# EAGLE board FPGA board V2 (EAGLE 7.6.0)
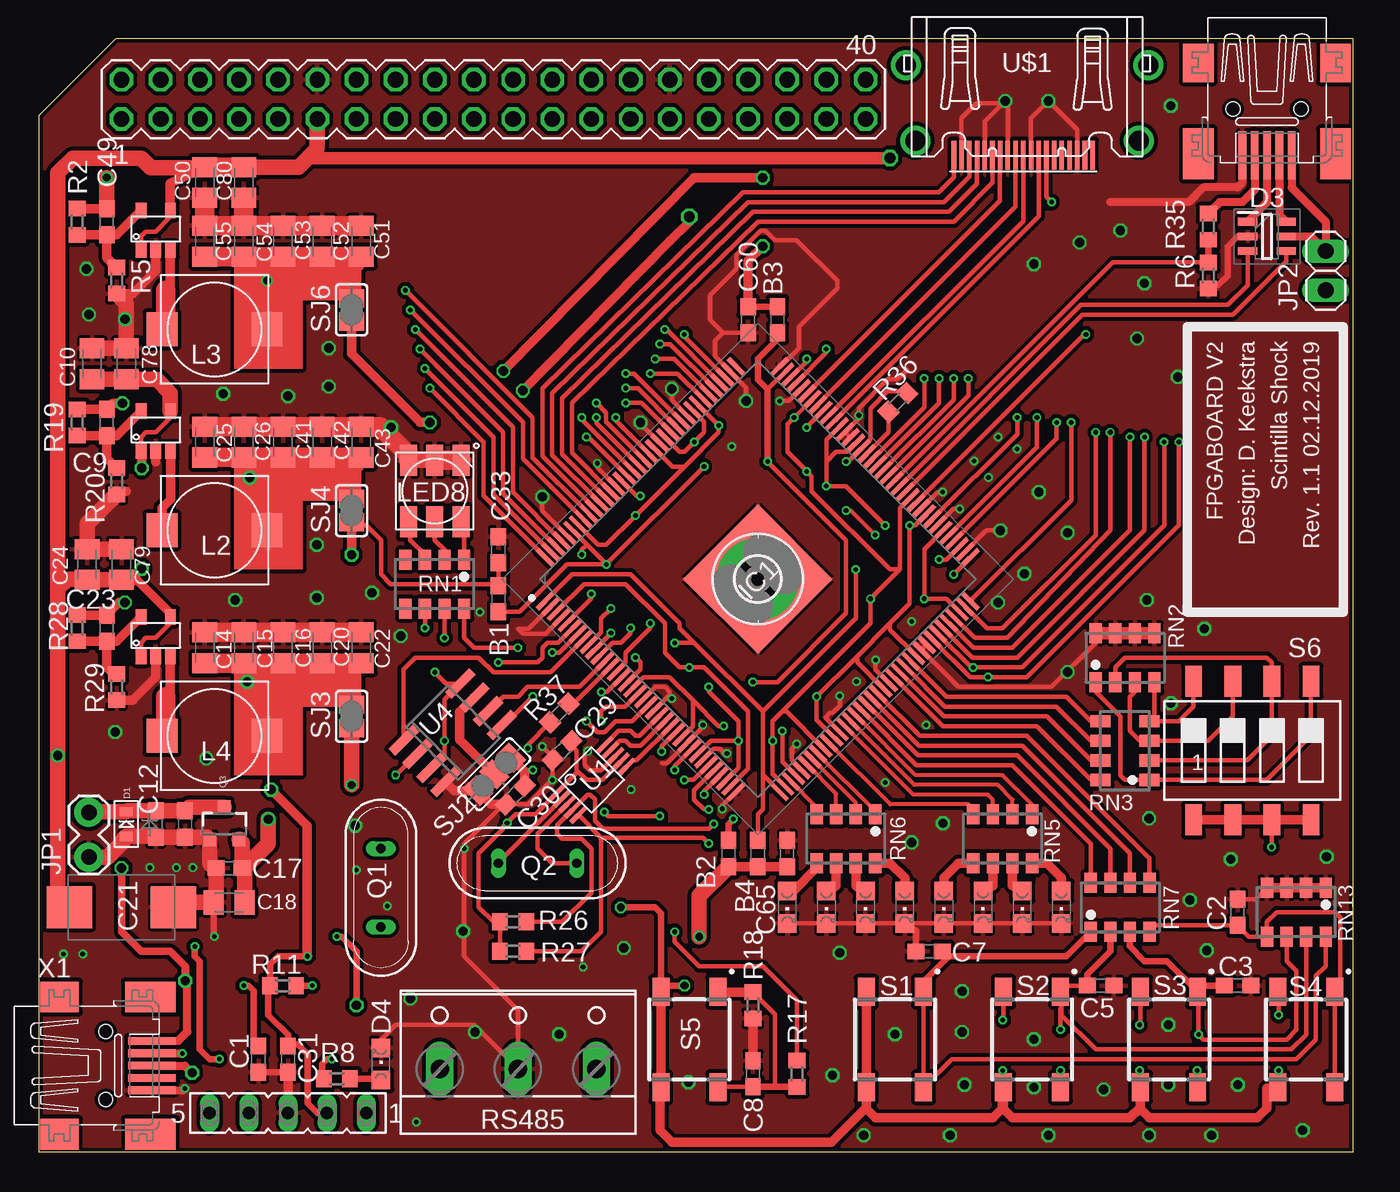
[diagram p6: board, top side]
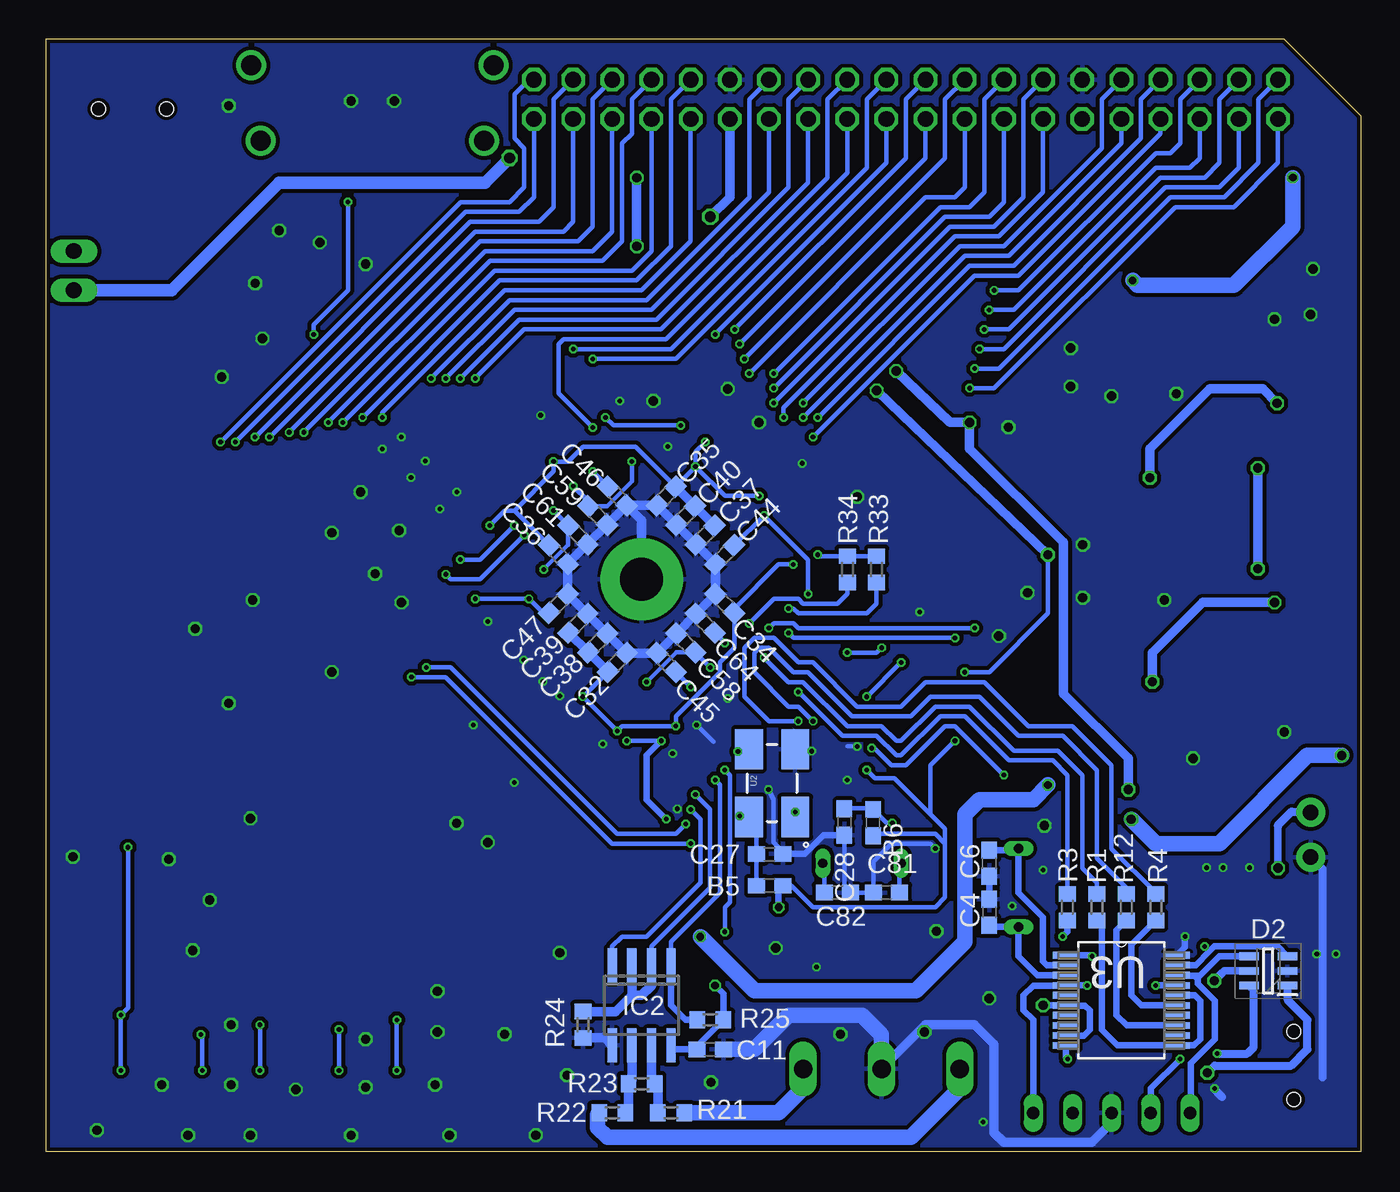
[diagram p7: board, bottom side, seen from below]

Size 85.26 x 72.19 mm. Coordinates in mm from the lower left corner, seen from the top.
Outline: 0,0 85.25,0 85.25,72.19 5,72.19 0,67.19 0,0
Copper layers (1*16): Top 0.018mm / dielectric 1.55mm / Bottom 0.018mm
Design rules "eC_2Layer_PClass6_BaseCopperO18_eCDefault *": minimum track width 0.15mm, minimum drill 0.3mm, track to track 0.15mm, track to pad 0.15mm, pad to pad 0.15mm, via to via 0.15mm, smd to smd 0mil, copper to edge 0.25mm, drill to drill 0.35mm, minimum pad ring 0.175mm, minimum via ring 0.125mm, stop-mask expansion 0mil, vias tented up to drill 0.35mm, thermal gap 0.2mm

## Footprints (pad centres in the part's own frame; a part is rotated, then mirrored left to right if it is on the bottom)
C0603 = smd 1.1 x 1: 1 -0.85,0; 2 0.85,0
C0805K = smd 1.3 x 1.6: 1 -1,0; 2 1,0
D/7343-31W = smd 2.95 x 2.7: + 3.375,0; - -3.375,0
SOD-523 = smd 0.8 x 0.6: A 0,-0.8; K 0,0.8
SOT95P275X110-6N = smd 1.25 x 0.5: 1 -1.25,0.95; 2 -1.25,0; 3 -1.25,-0.95; 4 1.25,-0.95; 5 1.25,0; 6 1.25,0.95
CHIPLED_0805 = smd 1.2 x 1.2: A 0,-1.05; C 0,1.05
2,8-PAD = drill 2.8 pad 5.334: B2,8 0,0
QFP50P2200X2200X165-145N = smd 1.475 x 0.3: 1 -10.738,8.75; 2 -10.738,8.25; 3 -10.738,7.75; 4 -10.738,7.25; 5 -10.738,6.75; 6 -10.738,6.25; 7 -10.738,5.75; 8 -10.738,5.25; 9 -10.738,4.75; 10 -10.738,4.25; 11 -10.738,3.75; 12 -10.738,3.25; 13 -10.738,2.75; 14 -10.738,2.25; 15 -10.738,1.75; 16 -10.738,1.25; 17 -10.738,0.75; 18 -10.738,0.25; 19 -10.738,-0.25; 20 -10.738,-0.75; 21 -10.738,-1.25; 22 -10.738,-1.75; 23 -10.738,-2.25; 24 -10.738,-2.75; 25 -10.738,-3.25; 26 -10.738,-3.75; 27 -10.738,-4.25; 28 -10.738,-4.75; 29 -10.738,-5.25; 30 -10.738,-5.75; 31 -10.738,-6.25; 32 -10.738,-6.75; 33 -10.738,-7.25; 34 -10.738,-7.75; 35 -10.738,-8.25; 36 -10.738,-8.75; 73 10.738,-8.75; 74 10.738,-8.25; 75 10.738,-7.75; 76 10.738,-7.25; 77 10.738,-6.75; 78 10.738,-6.25; 79 10.738,-5.75; 80 10.738,-5.25; 81 10.738,-4.75; 82 10.738,-4.25; 83 10.738,-3.75; 84 10.738,-3.25; 85 10.738,-2.75; 86 10.738,-2.25; 87 10.738,-1.75; 88 10.738,-1.25; 89 10.738,-0.75; 90 10.738,-0.25; 91 10.738,0.25; 92 10.738,0.75; 93 10.738,1.25; 94 10.738,1.75; 95 10.738,2.25; 96 10.738,2.75; 97 10.738,3.25; 98 10.738,3.75; 99 10.738,4.25; 100 10.738,4.75; 101 10.738,5.25; 102 10.738,5.75; 103 10.738,6.25; 104 10.738,6.75; 105 10.738,7.25; 106 10.738,7.75; 107 10.738,8.25; 108 10.738,8.75 | smd 0.3 x 1.475: 37 -8.75,-10.738; 38 -8.25,-10.738; 39 -7.75,-10.738; 40 -7.25,-10.738; 41 -6.75,-10.738; 42 -6.25,-10.738; 43 -5.75,-10.738; 44 -5.25,-10.738; 45 -4.75,-10.738; 46 -4.25,-10.738; 47 -3.75,-10.738; 48 -3.25,-10.738; 49 -2.75,-10.738; 50 -2.25,-10.738; 51 -1.75,-10.738; 52 -1.25,-10.738; 53 -0.75,-10.738; 54 -0.25,-10.738; 55 0.25,-10.738; 56 0.75,-10.738; 57 1.25,-10.738; 58 1.75,-10.738; 59 2.25,-10.738; 60 2.75,-10.738; 61 3.25,-10.738; 62 3.75,-10.738; 63 4.25,-10.738; 64 4.75,-10.738; 65 5.25,-10.738; 66 5.75,-10.738; 67 6.25,-10.738; 68 6.75,-10.738; 69 7.25,-10.738; 70 7.75,-10.738; 71 8.25,-10.738; 72 8.75,-10.738; 109 8.75,10.738; 110 8.25,10.738; 111 7.75,10.738; 112 7.25,10.738; 113 6.75,10.738; 114 6.25,10.738; 115 5.75,10.738; 116 5.25,10.738; 117 4.75,10.738; 118 4.25,10.738; 119 3.75,10.738; 120 3.25,10.738; 121 2.75,10.738; 122 2.25,10.738; 123 1.75,10.738; 124 1.25,10.738; 125 0.75,10.738; 126 0.25,10.738; 127 -0.25,10.738; 128 -0.75,10.738; 129 -1.25,10.738; 130 -1.75,10.738; 131 -2.25,10.738; 132 -2.75,10.738; 133 -3.25,10.738; 134 -3.75,10.738; 135 -4.25,10.738; 136 -4.75,10.738; 137 -5.25,10.738; 138 -5.75,10.738; 139 -6.25,10.738; 140 -6.75,10.738; 141 -7.25,10.738; 142 -7.75,10.738; 143 -8.25,10.738; 144 -8.75,10.738 | smd 6.85 x 6.85: 145 0,0
SO-08 = smd 0.6 x 2.2: 1 -1.905,-2.6; 2 -0.635,-2.6; 3 0.635,-2.6; 4 1.905,-2.6; 5 1.905,2.6; 6 0.635,2.6; 7 -0.635,2.6; 8 -1.905,2.6
1X02_LOCK = drill 1.016 pad 1.88: 1 -0.178,0; 2 2.718,0
1X02 = drill 1.016 long: 1 -1.27,0; 2 1.27,0
SLF7032T = smd 2 x 2.2: P$1 -3.4,0; P$2 3.4,0
RGBLED5050 = smd 2 x 1.1: 1 -2,1.7; 2 -2,0; 3 -2,-1.7; 4 2,-1.7; 5 2,0; 6 2,1.7
QS = drill 0.61 long: 1 -2.54,0; 2 2.54,0
SOT23-3 = smd 0.8 x 0.9: 1 -0.95,-1; 2 0.95,-1; 3 0,1.1
R0603 = smd 1 x 1.1: 1 -0.85,0; 2 0.85,0
744-8NS = smd 0.8 x 1.3: 1 -1.905,-1.587; 2 -0.635,-1.587; 3 0.635,-1.587; 4 1.905,-1.587; 5 1.905,1.587; 6 0.635,1.587; 7 -0.635,1.587; 8 -1.905,1.587
W237-3E = drill 1.194 long: 1 -5.08,-0.635; 2 0,-0.635; 3 5.08,-0.635
SKQGAKE010 = smd 1.8 x 1.1: 1 -3.1,1.85; 2 3.1,1.85; 3 -3.1,-1.85; 4 3.1,-1.85
SMS-004 = smd 1.092 x 2.007: 1 -3.81,-4.496; 2 -1.27,-4.496; 3 1.27,-4.496; 4 3.81,-4.496; 5 3.81,4.496; 6 1.27,4.496; 7 -1.27,4.496; 8 -3.81,4.496
SJ_2 = smd 1.168 x 1.6: 1 -1.524,0; 2 0,0; 3 1.524,0
SJ = smd 1.168 x 1.6: 1 -0.762,0; 2 0.762,0
FE05-1 = drill 0.813 long: 1 -5.08,0; 2 -2.54,0; 3 0,0; 4 2.54,0; 5 5.08,0
MA20-2 = drill 1.016 octagon: 1 -24.13,-1.27; 2 -24.13,1.27; 3 -21.59,-1.27; 4 -21.59,1.27; 5 -19.05,-1.27; 6 -19.05,1.27; 7 -16.51,-1.27; 8 -16.51,1.27; 9 -13.97,-1.27; 10 -13.97,1.27; 11 -11.43,-1.27; 12 -11.43,1.27; 13 -8.89,-1.27; 14 -8.89,1.27; 15 -6.35,-1.27; 16 -6.35,1.27; 17 -3.81,-1.27; 18 -3.81,1.27; 19 -1.27,-1.27; 20 -1.27,1.27; 21 1.27,-1.27; 22 1.27,1.27; 23 3.81,-1.27; 24 3.81,1.27; 25 6.35,-1.27; 26 6.35,1.27; 27 8.89,-1.27; 28 8.89,1.27; 29 11.43,-1.27; 30 11.43,1.27; 31 13.97,-1.27; 32 13.97,1.27; 33 16.51,-1.27; 34 16.51,1.27; 35 19.05,-1.27; 36 19.05,1.27; 37 21.59,-1.27; 38 21.59,1.27; 39 24.13,-1.27; 40 24.13,1.27
MSOP-10 = smd 1.4 x 0.3: 1 -2.2,1; 2 -2.2,0.5; 3 -2.2,0; 4 -2.2,-0.5; 5 -2.2,-1; 6 2.2,-1; 7 2.2,-0.5; 8 2.2,0; 9 2.2,0.5; 10 2.2,1
CRYSTAL-SMD-5X3_SOLDER = smd 2.6 x 1.8: 1 -2.2,-1.5; 2 2.2,-1.5; 3 2.2,1.5; 4 -2.2,1.5
SOP65P780X200-20N = smd 1.676 x 0.432: 1 -3.607,2.921; 2 -3.607,2.286; 3 -3.607,1.626; 4 -3.607,0.965; 5 -3.607,0.33; 6 -3.607,-0.33; 7 -3.607,-0.965; 8 -3.607,-1.626; 9 -3.607,-2.286; 10 -3.607,-2.921; 11 3.607,-2.921; 12 3.607,-2.286; 13 3.607,-1.626; 14 3.607,-0.965; 15 3.607,-0.33; 16 3.607,0.33; 17 3.607,0.965; 18 3.607,1.626; 19 3.607,2.286; 20 3.607,2.921
SOIC8 = smd 0.6 x 2.2: 1 -1.905,-2.6; 2 -0.635,-2.6; 3 0.635,-2.6; 4 1.905,-2.6; 5 1.905,2.6; 6 0.635,2.6; 7 -0.635,2.6; 8 -1.905,2.6
HDMI_A = smd 0.3 x 1.9: P$1 4.75,3.95; P$2 4.25,3.95; P$3 3.75,3.95; P$4 3.25,3.95; P$5 2.75,3.95; P$6 2.25,3.95; P$7 1.75,3.95; P$8 1.25,3.95; P$9 0.75,3.95; P$10 0.25,3.95; P$11 -0.25,3.95; P$12 -0.75,3.95; P$13 -1.25,3.95; P$14 -1.75,3.95; P$15 -2.25,3.95; P$16 -2.75,3.95; P$17 -3.25,3.95; P$18 -3.75,3.95; P$19 -4.25,3.95 | drill 1.3: P$20 -7.25,3; P$21 7.25,3; P$22 7.85,-1.9; P$23 -7.85,-1.9
TSOT-25 = smd 0.7 x 1: 1 -0.95,-1.2; 2 0,-1.2; 3 0.95,-1.2; 4 0.95,1.37; 5 -0.94,1.37
32005-201 = smd 3.1 x 0.5: 1 3,1.6; 2 3,0.8; 3 3,0; 4 3,-0.8; 5 3,-1.6 | smd 2.5 x 2: M1 -3,-4.45; M2 -3,4.45 | smd 3.3 x 2: M3 2.9,4.45; M4 2.9,-4.45 | hole 0.9: 0,2.2; 0,-2.2

## Placement (x,y rotation side)
B1  B-EU  [C0603]  29.83,35.86 270 top
B2  B-EU  [C0603]  44.75,19.35 90 top
B3  B-EU  [C0603]  47.92,53.96 270 top
B4  B-EU  [C0603]  46.65,19.35 90 top
B5  B-EU  [C0603]  38.35,17.26 180 bottom
B6  B-EU  [C0603]  31.64,21.35 90 bottom
C1  100nF  [C0603]  14.27,6.02 90 top
C2  100nF  [C0603]  77.77,15.54 90 top
C3  100nF  [C0603]  77.77,10.78 0 top
C4  16pF  [C0603]  24.11,15.54 270 bottom
C5  100nF  [C0603]  68.88,10.78 180 top
C6  16pF  [C0603]  24.11,18.72 90 bottom
C7  100nF  [C0603]  57.77,13 0 top
C8  100nF  [C0603]  46.34,5.07 90 top
C9  22pF  [C0603]  4.43,47.29 270 top
C10  10uF X5R  [C0805K]  3.47,51.1 90 top
C11  100nF  [C0603]  42.21,6.65 0 bottom
C12  22pF  [C0603]  7.6,21.26 270 top
C13  100nF  [C0603]  9.51,21.26 270 top
C14  10uF X5R  [C0805K]  10.78,32.69 90 top
C15  10uF X5R  [C0805K]  13.32,32.69 90 top
C16  10uF X5R  [C0805K]  15.86,32.69 90 top
C17  100nF  [C0603]  12.36,18.4 180 top
C18  10uF X5R  [C0805K]  12.36,16.18 180 top
C20  10uF X5R  [C0805K]  18.4,32.69 90 top
C21  330uF 10V (10tpe330m)  [D/7343-31W]  5.38,15.86 180 top
C22  10uF X5R  [C0805K]  20.94,32.69 90 top
C23  22pF  [C0603]  4.43,33.96 270 top
C24  10uF X5R  [C0805K]  3.16,38.09 90 top
C25  10uF X5R  [C0805K]  10.78,46.02 90 top
C26  10uF X5R  [C0805K]  13.32,46.02 90 top
C27  100nF  [C0603]  38.35,19.32 180 bottom
C28  100nF  [C0603]  33.5,21.39 90 bottom
C29  100nF  [C0603]  33.95,26.02 225 top
C30  100nF  [C0603]  30.91,23.14 45 top
C31  100nF  [C0603]  16.17,6.02 270 top
C32  100nF  [C0603]  48.24,31.74 45 bottom
C33  100nF  [C0603]  29.83,39.04 90 top
C34  100nF  [C0603]  41.26,35.55 135 bottom
C35  100nF  [C0603]  45.07,42.53 225 bottom
C36  100nF  [C0603]  52.05,38.72 315 bottom
C37  100nF  [C0603]  42.53,39.99 225 bottom
C38  100nF  [C0603]  49.51,33.01 45 bottom
C39  100nF  [C0603]  50.78,34.28 45 bottom
C40  100nF  [C0603]  43.8,41.26 225 bottom
C41  10uF X5R  [C0805K]  15.86,46.02 90 top
C42  10uF X5R  [C0805K]  18.4,46.02 90 top
C43  10uF X5R  [C0805K]  20.94,46.02 90 top
C44  100nF  [C0603]  41.26,38.72 225 bottom
C45  100nF  [C0603]  45.07,31.74 135 bottom
C46  100nF  [C0603]  48.24,42.53 315 bottom
C47  100nF  [C0603]  52.05,35.55 45 bottom
C49  22pF  [C0603]  4.43,60.31 270 top
C50  10uF X5R  [C0805K]  10.78,62.85 270 top
C51  10uF X5R  [C0805K]  20.94,59.04 90 top
C52  10uF X5R  [C0805K]  18.4,59.04 90 top
C53  10uF X5R  [C0805K]  15.86,59.04 90 top
C54  10uF X5R  [C0805K]  13.32,59.04 90 top
C55  10uF X5R  [C0805K]  10.78,59.04 90 top
C58  100nF  [C0603]  43.8,33.01 135 bottom
C59  100nF  [C0603]  49.51,41.26 315 bottom
C60  100nF  [C0603]  46.02,53.96 270 top
C61  100nF  [C0603]  50.78,39.99 315 bottom
C64  100nF  [C0603]  42.53,34.28 135 bottom
C65  100nF  [C0603]  48.56,19.35 90 top
C78  10uF X5R  [C0805K]  5.7,51.1 90 top
C79  10uF X5R  [C0805K]  5.38,38.09 90 top
C80  10uF X5R  [C0805K]  13.32,62.85 270 top
C81  16pF  [C0603]  30.78,16.81 0 bottom
C82  16pF  [C0603]  33.95,16.81 180 bottom
D1  Bi TVS 5V  [SOD-523]  5.7,21.26 0 top
D2  IP4234CZ6,125  [SOT95P275X110-6N]  6.01,11.73 180 bottom
D3  IP4234CZ6,125  [SOT95P275X110-6N]  79.67,59.36 0 top
D4  LED0805  [CHIPLED_0805]  22.21,5.7 0 top
H1  Ground pad for FPGA  [2,8-PAD]  46.65,37.13 0 top
IC1  10CL016YE144C8G  [QFP50P2200X2200X165-145N]  46.65,37.13 45 top
IC2  Any 3.3v rs485  [SO-08]  46.65,9.51 180 bottom
JP1  M02LOCK  [1X02_LOCK]  3.27,19.29 90 top
JP2  [1X02]  83.48,57.14 90 top
L2  3.3uH 1.9A PWR  [SLF7032T]  11.41,40.31 180 top
L3  3.3uH 1.9A PWR  [SLF7032T]  11.41,53.33 180 top
L4  3.3uH 1.9A PWR  [SLF7032T]  11.41,26.97 180 top
LED0  LED0805  [CHIPLED_0805]  48.56,15.86 180 top
LED1  LED0805  [CHIPLED_0805]  51.1,15.86 180 top
LED2  LED0805  [CHIPLED_0805]  53.64,15.86 180 top
LED3  LED0805  [CHIPLED_0805]  56.18,15.86 180 top
LED4  LED0805  [CHIPLED_0805]  58.72,15.86 180 top
LED5  LED0805  [CHIPLED_0805]  61.26,15.86 180 top
LED6  LED0805  [CHIPLED_0805]  63.8,15.86 180 top
LED7  LED0805  [CHIPLED_0805]  66.34,15.86 180 top
LED8  RGBLED5050  [RGBLED5050]  25.7,42.85 90 top
Q1  12MHz  [QS]  22.21,17.13 270 top
Q2  25MHz  [QS]  32.37,18.72 180 top
Q3  NTR2101P  [SOT23-3]  12.05,21.26 0 top
R1  0  [R0603]  17.13,15.86 90 bottom
R2  32k  [R0603]  2.52,60.31 90 top
R3  0  [R0603]  19.03,15.86 90 bottom
R4  0  [R0603]  13.32,15.86 90 bottom
R5  10k  [R0603]  5.06,56.5 90 top
R6  200  [R0603]  75.86,56.82 90 top
R8  1k  [R0603]  19.35,4.75 180 top
R11  10k  [R0603]  15.86,10.78 180 top
R12  0  [R0603]  15.22,15.86 90 bottom
R17  1k  [R0603]  49.19,5.07 90 top
R18  10k  [R0603]  46.34,9.51 90 top
R19  150k  [R0603]  2.52,47.29 90 top
R20  33k  [R0603]  5.06,43.48 90 top
R21  10  [R0603]  44.75,2.53 0 bottom
R22  10  [R0603]  48.56,2.53 180 bottom
R23  120  [R0603]  46.65,4.43 0 bottom
R24  10k  [R0603]  50.46,8.24 90 bottom
R25  10k  [R0603]  42.21,8.56 180 bottom
R26  2k2  [R0603]  30.78,14.91 0 top
R27  2k2  [R0603]  30.78,13 0 top
R28  100k  [R0603]  2.52,33.96 90 top
R29  100k  [R0603]  5.06,30.15 90 top
R33  10k  [R0603]  31.41,37.77 270 bottom
R34  10k  [R0603]  33.32,37.77 270 bottom
R35  100  [R0603]  75.86,59.99 90 top
R36  10k  [R0603]  55.74,48.6 45 top
R37  25R  [R0603]  33.78,28.45 45 top
RN1  1k  [744-8NS]  25.7,36.82 180 top
RN2  10k  [744-8NS]  70.47,32.05 0 top
RN3  1k  [744-8NS]  70.47,26.02 90 top
RN5  1k  [744-8NS]  62.53,20.31 180 top
RN6  1k  [744-8NS]  52.37,20.31 180 top
RN7  1k  [744-8NS]  70.15,15.86 0 top
RN13  10k  [744-8NS]  81.58,15.54 180 top
RS485  [W237-3E]  31.1,6.02 0 top
S1  SKQGADE010  [SKQGAKE010]  55.54,7.29 270 top
S2  SKQGADE010  [SKQGAKE010]  64.43,7.29 270 top
S3  SKQGADE010  [SKQGAKE010]  73.32,7.29 270 top
S4  SKQGADE010  [SKQGAKE010]  82.21,7.29 270 top
S5  SKQGADE010  [SKQGAKE010]  42.21,7.29 270 top
S6  SWS004  [SMS-004]  78.72,26.02 0 top
SJ2  [SJ_2]  29.56,24.49 225 top
SJ3  [SJ]  20.3,28.24 270 top
SJ4  [SJ]  20.3,41.58 270 top
SJ6  [SJ]  20.3,54.6 270 top
SV1  [FE05-1]  16.17,2.53 180 top
SV4  [MA20-2]  29.51,68.25 0 top
U1  [MSOP-10]  35.86,24.12 45 top
U2  OSCILLATOR5X3_SOLDER  [CRYSTAL-SMD-5X3_SOLDER]  38.19,23.92 90 bottom
U3  PIC18F14K50-I/SS  [SOP65P780X200-20N]  15.54,9.83 0 bottom
U4  IS25LQ040B-JNLE  [SOIC8]  26.87,27.18 315 top
U$1  HDMI  [HDMI_A]  64.12,68.57 180 top
U$3  AP3429  [TSOT-25]  7.6,46.66 0 top
U$7  AP3429  [TSOT-25]  7.6,33.32 0 top
U$11  AP3429  [TSOT-25]  7.6,59.68 0 top
X1  MINI-USB-32005-201  [32005-201]  4.36,5.6 0 top
X2  MINI-USB-32005-201  [32005-201]  79.67,67.61 270 top

## Tracks (layer width: path | path; a pad name or v marks a point on that pad's centre or on a via)
50MHZ_OUT  (via drill 0.3)
  Top 0.305: v40.41,25.97 40.41,26.29 IC1.25
  Bottom 0.305: U2.3 39.81,25.7 v40.41,25.97
+1V2  (via drill 0.5)
  Top 0.61: B2.1 B4.1 C65.1
  Top 1.016: SJ3.2 v20.3,23.8 | v42.84,13.96 42.84,16.6 B2.1
  Bottom 1.016: v42.84,13.96 39.35,10.46 28.87,10.46 25.7,13.64 25.7,21.89 24.75,22.85 21.25,22.85 v20.3,23.8
+2V5  (via drill 0.3, 0.6)
  Top 0.406: B3.1 C60.1 | v17.44,12.69 15.54,12.69 15.01,12.15 R11.2 14.9,10.78 14.9,10.68 14.9,10.27 14.9,8.88 16.17,7.61 C31.1 16.28,6.97 16.81,6.97 17.44,6.34 17.44,3.16 18.08,2.53 SV1.2
  Top 0.61: SJ6.2 20.3,51.74 24.75,47.3 v25.38,47.3 | C60.1 46.02,57.77 v46.97,58.72 | v46.97,63.17 42.53,63.17 v30.14,50.63 | v15.09,23.49 17.42,21.16 17.42,12.71 v17.44,12.69
  Bottom 0.406: U3.1 17.51,12.75 v17.44,12.69
  Bottom 0.61: v46.97,58.72 v46.97,63.17 | v30.14,50.63 26.65,47.3 v25.38,47.3 25.38,45.61 19.29,39.52 19.29,29.71 15.09,25.51 v15.09,23.49
+3V3  (via drill 0.3, 0.5, 0.6, 0.7)
  Top 0.305: U4.3 25.52,24.9 26.33,25.7 v26.33,26.66 26.33,29.34 U4.8 26.43,30.37 v25.7,31.1 | v32.05,24.75 31.57,24.75 31.51,24.7 | C33.1 B1.1 29.72,36.82 22.84,36.82 22.21,37.45 22.21,39.67 21.25,40.63 20.49,40.63 SJ4.2 20.43,40.95 | S2.3 62.58,8.6 v62.54,8.56 | v62.54,5.29 62.54,4.23 S2.4 | S3.3 71.47,8.31 v71.41,8.24 | v71.41,5.29 71.41,4.25 S3.4 | S4.4 80.36,5.38 v80.43,5.29 | v80.43,8.87 80.43,10.32 S4.3 | S6.3 79.99,19.78 v79.97,19.76
  Top 0.406: v41.89,10.78 40.75,10.78 S5.3 40.36,15.49 39.99,15.86 v37.76,15.86 | 40.3,2.53 40.3,2.85
  Top 0.61: SJ2.1 31.51,24.7 C30.2 | 53.69,2.79 S1.4 S1.3 | 53.69,2.79 54.27,2.21 61.89,2.21 62.53,2.85 62.53,4.13 S2.4 62.58,2.79 63.16,2.21 70.78,2.21 71.42,2.85 | 71.42,2.85 72.05,2.21 79.04,2.21 79.67,2.85 79.67,4.13 S4.4 | S3.4 71.47,2.9 71.42,2.85 | 53.69,2.79 53.58,2.79 51.42,0.62 41.07,0.62 40.3,1.39 40.3,2.85 40.3,4.13 S5.4 | S5.4 S5.3 | S6.1 S6.2 S6.3 S6.4 | v31.41,49.36 40.94,59.04 42.21,60.31 v42.21,60.63 | v20.3,38.72 SJ4.2 | 40.29,1.56 40.29,4.12 S5.4
  Bottom 0.305: 26.97,19.99 27.6,20.62 31.52,20.62 B6.1 | v32.05,24.75 31.52,24.22 30.25,24.22 27.92,21.89 | 26.97,19.99 26.97,20.94 27.92,21.89 | 27.92,21.89 27.92,25.07 v26.33,26.66 | 26.97,19.99 26.97,16.5 27.6,15.86 35.54,15.86 36.94,17.26 B5.1 | v25.7,31.1 24.11,31.1 20.3,34.91 v20.3,38.72 | v62.54,8.56 v62.54,5.29 | v71.41,8.24 v71.41,5.29 | v80.43,5.29 v80.43,8.87 79.97,9.34 v79.97,19.76
  Bottom 0.406: IC2.8 44.49,6.66 C11.1 43.06,6.76 42.84,6.97 42.84,7.08 R25.1 41.36,10.25 v41.89,10.78 | v37.76,15.86 37.76,16.9 B5.1
  Bottom 0.61: IC2.8 44.75,7.19 | v31.41,49.36 v20.3,38.72 | SV4.29 40.94,61.9 v42.21,60.63
+5V  (via drill 0.6, 0.7)
  Top 0.305: U$3.4 8.55,47.61 7.6,46.66 6.97,46.66 6.65,46.34 U$3.1 6.69,45.42 | U$7.4 8.55,34.27 7.6,33.33 6.97,33.33 6.65,33.01 U$7.1 | U$11.1 6.65,59.36 6.97,59.68 7.6,59.68 8.55,60.63 U$11.4 | 6.38,37.09 6.38,37.49
  Top 0.61: 8.51,48.08 U$3.4 | C50.1 8.55,62.81 U$11.4 | 6.69,45.42 v6.69,44.34 | v6.69,37.8 6.63,37.8 | 6.63,37.8 5.91,37.09 | 6.38,37.09 8.55,34.91 U$7.4 | 6.63,37.8 6.63,37.74 6.38,37.49
  Top 0.813: v55.23,64.44 17.4,64.44 16.81,63.85
  Top 1.016: 1.25,36.5 1.25,63.49 2.2,64.44 6.65,64.44 7.28,63.8 13.27,63.8 C80.1 16.81,63.85 16.86,63.85 18.08,65.08 SV4.11 | 1.25,36.5 1.89,37.13 3.11,37.13 C24.1 C79.1 5.91,37.09 | U$3.4 8.55,49.2 7.65,50.1 C78.1 C10.1 | 1.25,36.5 v1.25,25.7 1.25,16.61 C21.+ 1.89,15.74 | Q3.2 13.21,20.04 C17.1 13.36,18.25 C18.1 13.36,18.45 14.9,19.99 v14.9,21.58
  Top 1.27: C50.1 C80.1
  Bottom 0.61: v6.69,44.34 v6.69,37.8
  Bottom 0.813: JP2.1 77.13,55.87 70.15,62.85 56.81,62.85 v55.23,64.44
  Bottom 1.016: v1.25,25.7 3.47,25.7 9.19,19.99 13.32,19.99 v14.9,21.58
CLK_SCL  (via drill 0.3)
  Top 0.305: R26.2 33.95,14.91 35.86,16.82 35.86,19.67 35.22,20.31 33.95,20.31 33.64,20.62 33.64,21.19 U1.4 35.61,23.16 35.78,23.16 36.09,22.85 36.09,21.47 36.62,20.94 43.48,20.94 v43.8,21.26 | IC1.66 60.5,31.42 v60.62,31.42 63.8,31.42 73.01,40.63 v73.01,46.02
  Bottom 0.305: v43.8,21.26 44.43,20.62 48.24,20.62 59.04,31.42 v60.62,31.42 | SV4.39 53.64,61.9 54.59,60.95 58.08,60.95 v73.01,46.02
CLK_SDA  (via drill 0.3)
  Top 0.305: 36.49,20.37 U1.5 | R27.2 35.22,13.01 36.49,14.28 36.49,20.37 | 36.49,20.37 43.1,20.37 v43.48,19.99 | IC1.65 60.43,30.79 v61.58,30.79 64.12,30.79 73.96,40.63 v73.96,46.02
  Bottom 0.305: v43.48,19.99 48.56,19.99 59.35,30.79 v61.58,30.79 | SV4.40 53.96,69.52 54.91,68.57 54.91,65.71 54.27,65.08 54.27,62.53 55.23,61.58 58.4,61.58 v73.96,46.02
D+  (via drill 0.3)
  Top 0.406: v10.14,13.32 10.14,12.69 10.46,12.37 10.46,6.66 11.09,6.02 v11.73,6.02
  Bottom 0.406: 9.82,13.01 9.51,13.32 5.4,13.32 D2.3 | U3.19 10.71,12.12 9.82,13.01 | 9.82,13.01 v10.14,13.32 | v11.73,6.02 13.63,4.12 SV1.4
D-
  Bottom 0.406: D2.4 9.19,12.69 10.46,11.42 10.79,11.42 | U3.18 11.89,11.42 10.79,11.42 | 10.79,11.42 10.58,11.2 10.58,10.89 9.49,9.8 9.49,7.31 11.05,5.76 11.05,2.58 SV1.5
FL_CE
  Top 0.305: IC1.8 33.2,31.1 29.51,31.1 28.56,32.05 24.43,32.05 23.68,31.31 U4.1
FL_CLK
  Top 0.305: U4.6 29.2,28.57 30.14,29.52 31.1,29.52 31.73,30.15 35.07,30.15 IC1.12
FL_SI  (via drill 0.3)
  Top 0.305: U4.5 30.21,27.68 v32.05,29.52 | v29.83,31.74 32.37,31.74 32.68,32.05 32.68,32.69 33,33.01 33.69,33.01 IC1.6
  Bottom 0.305: v32.05,29.52 v29.83,31.74
FL_SO
  Top 0.305: R37.2 34.68,29.05 IC1.13
GND  (via drill 0.3, 0.6)
  Top 0.254: IC1.95 IC1.96
  Top 0.305: IC1.19 40.02,30.15 40.62,30.15 40.94,29.83 40.94,29.65 40.69,29.4 | 40.69,29.4 IC1.21 | C29.2 33.35,24.15 v33.32,24.12 31.74,22.54 C30.1 30.16,22.54 27.6,19.99 v27.6,19.67 27.6,12.69 31.1,9.2 RS485.2 28.24,8.24 23.16,8.24 22.21,7.29 D4.C | U1.8 36.48,24.74 35.78,24.74 35.4,25.11 35.4,25.76 v35.63,25.98 | LED0.C LED1.C LED2.C LED3.C LED4.C LED5.C LED6.C LED7.C | IC1.64 IC1.63 59.65,30.15 65.7,30.15 68.56,33.01 RN2.8 | C2.2 78.94,16.39 RN13.4 | v39.05,47.3 39.2,47.14 39.2,47.06 IC1.123 | v41.07,49.47 41.07,48.73 IC1.118 | v32.67,42.47 32.67,41.57 IC1.140 | v36.25,44.65 36.25,44.36 IC1.131 | v45.9,48.7 45.9,49.56 IC1.110 43.87,51.58 43.87,52.58 44.4,53.11 | C60.2 44.4,53.11 | IC1.108 48.12,50.91 49.32,52.12 49.32,53.52 51.81,56.01 51.81,56.47 49.16,59.12 47.76,59.12 47.14,59.74 46.83,59.74 45.27,58.19 45.27,57.25 43.56,55.54 43.56,53.95 44.4,53.11 | v48.07,48.7 48.67,48.7 IC1.104 | 56.32,50.72 55.7,50.09 55.07,50.09 53.21,48.23 v53.21,47.76 53.21,47.58 IC1.96 | v58.65,42.78 58.31,42.78 IC1.82 | v62.39,40.29 61.48,40.29 IC1.74 | v59.74,41.69 59.34,41.69 IC1.79 | U$1.P$17 67.37,66.27 v65.5,68.14 64.37,67.01 U$1.P$11 | U$1.P$8 62.87,67.97 v62.7,68.14 | U$1.P$5 61.37,66.81 v62.7,68.14 | U$1.P$2 59.87,67.02 60.83,67.99 62.54,67.99 v62.7,68.14 | v54.3,31.89 54.3,31.26 IC1.57 | v51.96,29.56 51.96,28.94 51.49,28.47 51.34,28.47 51.03,28.16 IC1.48 | v49.16,26.45 48.85,26.14 48.85,25.39 IC1.41 | v44.65,25.82 44.49,25.82 44.18,26.14 43.79,26.14 IC1.30 | v44.34,22.25 44.34,22.45 IC1.36 | v41.07,29.4 40.69,29.4 | IC1.2 31.77,33.91 31.11,33.91 31.43,33.6 32.87,33.6 IC1.4 | 33.6,25.36 v32.67,26.29
  Top 0.305: 40.45,25.2 40.76,25.2 42.07,26.51 IC1.27 43.09,27.57
  Top 0.406: X2.5 78.07,64.11 | D3.2 77.77,59.36 77.13,58.73 77.13,56.82 76.5,56.19 76.08,56.19 R6.1 75.65,56.19 | C31.2 C1.1 | v11.41,13.96 11.36,14.01 C18.2 | C7.1 56.92,14.38 LED3.C
  Top 0.508: X2.5 78.07,62.84 77.77,62.53 75.55,62.53 74.59,61.58 69.51,61.58 | X1.5 9.39,4 v9.51,4.12
  Top 0.61: U$7.2 7.6,30.79 6.12,29.3 R29.1 | R5.1 6.12,55.65 7.6,57.14 U$11.2 | U$3.2 7.6,44.76 | 5.7,42.85 5.28,42.85 R20.1 | C30.1 29.36,22.54 SJ2.3 26.96,23.41 U4.4 | RN13.1 RN13.2 RN13.3 RN13.4 | C8.2 R18.1 | SV1.3 C31.2
  Top 0.813: RN2.5 RN2.6 RN2.7 RN2.8
  Top 1.016: LED8.5 LED8.6 | C79.2 C24.2 3.16,40.73 R20.1 | C10.2 C78.2 5.7,55.02 R5.1 | C21.- 8.55,15.86 8.87,16.18 C18.2 11.51,16.33 C17.2 11.41,18.4 11.09,18.72 Q3.1 10.95,20.41 C13.2 C12.2 7.55,20.46 D1.A 5.5,20.26 5.5,20.12 4.49,19.11 JP1.1
  Top 1.27: C25.2 C26.2 C41.2 C42.2 C43.2 22.16,47.02 24,45.19 LED8.6 | C14.2 C15.2 C16.2 C20.2 C22.2 | C54.2 C55.2 C50.2 | C54.2 C53.2 C52.2 C51.2 | LED8.4 LED8.5 | C80.2 C54.2
  Bottom 0.254: 51.45,36.07 51.37,36.07 C39.2
  Bottom 0.305: C28.1 33.5,16.9 C82.1 C81.1 31.63,18.82 30.46,19.99 27.92,19.99 v27.6,19.67 | v35.63,25.98 36.56,25.98 U2.2 | v32.67,26.29 33.29,26.29 | v38.43,23.49 38.12,22.87 38.12,20.07 37.34,19.29 37.49,19.29 | v43.09,27.69 42.01,26.6
  Bottom 0.406: C4.1 C6.1 | U3.20 11.41,13.27 v11.41,13.96 | C28.1 34.85,20.54 36.07,19.32 C27.1
  Bottom 0.508: 2.84,18.68 JP1.1 2.49,18.34 2.49,4.82 | v9.51,4.12 9.51,4.06 9.02,3.58
  Bottom 0.61: U2.2 36.57,25.15 | R24.1 49.04,7.39 IC2.5 | 51.45,36.07 C47.2 | C47.2 C36.2 C61.2 C59.2 47.67,41.9 47.61,41.9 46.65,40.95 H1.B2,8 | C46.2 C35.2 C40.2 C37.2 C44.2 C34.2 C64.2 C58.2 C45.2 C32.2 C38.2 C39.2 C47.2 | SV1.3 16.17,1.89 17.44,0.62 23.16,0.62 23.79,1.26 23.79,6.97 25.06,8.24 28.24,8.24 RS485.2
  Bottom 1.016: RS485.2 31.1,7.61 32.37,8.88 37.13,8.88 39.35,6.66 C11.2
  other vias: 20.54,21.16 27.54,14.31 37.96,13.22 28.31,7.78 33.76,7.62 42.16,4.51 55.54,7.62 59.9,10.42 59.9,7.78 51.96,12.91 53.52,1.09 59.12,1.09 60.05,4.36 64.56,7.31 69.08,4.04 65.5,1.09 64.56,4.2 73.28,4.36 77.79,4.36 75.77,13.07 73.28,8.25 74.68,16.34 77.32,18.98 83.54,19.14 81.99,1.4 76.08,1.09 72.03,1.09 72.03,21.62 73.43,29.09 75.61,33.92 71.88,35.78 64.87,42.78 71.25,52.74 73.9,50.25 64.56,57.56 67.52,58.96 70.16,59.74 71.72,56.32 73.43,67.83 18.82,49.63 18.82,52.12 16.18,49.01 11.98,49.16 18.05,35.94 12.76,35.78 18.05,39.36 10.89,25.51 4.98,27.23 24.11,9.96 21.62,36.25 23.49,33.45 44.96,45.74 60.67,44.81 62.23,46.36 63.47,45.58 61.61,43.72 66.74,40.14 63.94,37.49 62.23,35.63 22.87,46.98 56.63,20.07 58.65,21.31 54.92,23.96 57.56,27.69 53.05,30.49 22.63,15.94 20.6,18.27 24.49,1.94 1.62,12.83 2.87,12.83 7.22,18.43 8.93,18.43 10.02,18.43 66.74,31.11 35.32,11.98 51.5,4.98 3.11,57.25 3.27,54.3 5.6,53.98 56.63,34.38 28.63,35
  pour Top (isolate 0.254): 85.57,72.34 -0.16,72.34 -0.16,-0.31 85.57,0
  pour Bottom (isolate 0.254): 0,0 85.41,0 85.41,72.34 0,72.34
GPI_7  (via drill 0.3)
  Top 0.305: v35.54,46.34 35.68,46.34 IC1.129
  Bottom 0.305: SV4.7 13,66.03 22.21,56.82 25.06,56.82 v35.54,46.34
GPI_8  (via drill 0.3)
  Top 0.305: v35.22,47.61 35.22,47.5 IC1.128
  Bottom 0.305: SV4.8 14.27,68.25 14.27,65.71 22.52,57.45 25.38,57.45 v35.22,47.61
GPI_9  (via drill 0.3)
  Top 0.305: v36.18,47.61 36.18,47.26 IC1.127
  Bottom 0.305: SV4.9 15.54,65.39 22.84,58.09 25.7,58.09 v36.18,47.61
GPI_10  (via drill 0.3)
  Top 0.305: v36.18,48.56 36.81,47.93 36.81,47.33 IC1.126
  Bottom 0.305: SV4.10 16.81,68.25 16.81,65.08 23.16,58.73 26.02,58.73 v36.18,48.56
GPI_23  (via drill 0.3)
  Top 0.305: v57.45,50.15 57.45,48.28 IC1.91
  Bottom 0.305: SV4.25 35.86,62.85 45.38,53.33 54.27,53.33 v57.45,50.15
GPI_24  (via drill 0.3)
  Top 0.305: v58.4,50.15 58.4,48.53 IC1.90
  Bottom 0.305: SV4.26 37.13,68.25 37.13,62.53 45.7,53.96 54.59,53.96 v58.4,50.15
GPI_25  (via drill 0.3)
  Top 0.305: v59.35,50.15 59.35,48.77 IC1.89
  Bottom 0.305: SV4.27 38.4,62.22 46.02,54.6 54.91,54.6 v59.35,50.15
GPI_26  (via drill 0.3)
  Top 0.305: v60.31,50.15 60.31,49.02 IC1.88
  Bottom 0.305: SV4.28 39.67,68.25 39.67,61.9 46.34,55.23 55.23,55.23 v60.31,50.15
GPIO_1  (via drill 0.3)
  Top 0.305: v25.38,49.52 28.87,46.02 28.87,42.54 IC1.144
  Bottom 0.305: SV4.1 5.38,64.12 8.24,61.27 12.05,61.27 23.79,49.52 v25.38,49.52
GPIO_2  (via drill 0.3)
  Top 0.305: v25.06,50.79 29.51,46.34 29.51,42.61 IC1.143
  Bottom 0.305: SV4.2 6.65,68.25 6.65,64.12 8.87,61.9 12.36,61.9 23.48,50.79 v25.06,50.79
GPIO_3  (via drill 0.3)
  Top 0.305: v24.75,52.06 30.14,46.66 30.14,42.69 IC1.142
  Bottom 0.305: SV4.3 7.92,63.8 9.19,62.53 12.68,62.53 23.16,52.06 v24.75,52.06
GPIO_4  (via drill 0.3)
  Top 0.305: v24.43,53.33 30.78,46.98 30.78,42.76 IC1.141
  Bottom 0.305: SV4.4 9.19,68.25 9.19,64.12 10.14,63.17 13,63.17 22.84,53.33 v24.43,53.33
GPIO_5  (via drill 0.3)
  Top 0.305: v24.11,54.6 31.41,47.3 31.41,44.95 IC1.137
  Bottom 0.305: SV4.5 10.46,64.44 11.09,63.8 13.32,63.8 22.52,54.6 v24.11,54.6
GPIO_6  (via drill 0.3)
  Top 0.305: v23.79,55.87 32.05,47.61 32.05,45.02 IC1.136
  Bottom 0.305: SV4.6 11.73,68.25 11.73,65.39 12.36,64.76 13.32,64.76 22.21,55.87 v23.79,55.87
GPIO_11  (via drill 0.3)
  Top 0.305: v37.45,47.61 37.45,47.4 IC1.125
  Bottom 0.305: SV4.13 20.62,62.22 23.48,59.36 26.33,59.36 37.45,48.25 v37.45,47.61
GPIO_12  (via drill 0.3)
  Top 0.305: v38.08,48.56 39.11,48.56 IC1.121
  Bottom 0.305: SV4.14 21.89,68.25 21.89,61.9 23.79,59.99 26.65,59.99 v38.08,48.56
GPIO_13  (via drill 0.3)
  Top 0.305: v38.08,49.52 38.87,49.52 IC1.120
  Bottom 0.305: SV4.15 23.16,61.58 24.11,60.63 26.97,60.63 v38.08,49.52
GPIO_14  (via drill 0.3)
  Top 0.305: v38.08,50.47 38.62,50.47 IC1.119
  Bottom 0.305: SV4.16 24.43,68.25 24.43,62.22 25.38,61.27 27.29,61.27 v38.08,50.47
GPIO_15  (via drill 0.3)
  Top 0.305: v39.67,50.47 41.45,50.47 IC1.115
  Bottom 0.305: SV4.17 25.7,62.53 26.33,61.9 28.24,61.9 v39.67,50.47
GPIO_16  (via drill 0.3)
  Top 0.305: v39.99,51.42 41.2,51.42 IC1.114
  Bottom 0.305: SV4.18 26.97,68.25 26.97,64.44 v39.99,51.42
GPIO_17  (via drill 0.3)
  Top 0.305: v40.3,52.38 40.96,52.38 IC1.113
  Bottom 0.305: SV4.19 28.24,64.44 v40.3,52.38
GPIO_18  (via drill 0.3)
  Top 0.305: v40.62,53.33 40.71,53.33 IC1.112
  Bottom 0.305: SV4.20 29.51,68.25 29.51,64.44 v40.62,53.33
GPIO_19  (via drill 0.3)
  Top 0.305: v41.89,53.01 41.89,52.86 IC1.111
  Bottom 0.305: SV4.21 30.78,64.12 v41.89,53.01
GPIO_20  (via drill 0.3)
  Top 0.305: v49.83,51.42 49.83,51.27 IC1.106
  Bottom 0.305: SV4.22 32.05,68.25 32.05,63.8 44.43,51.42 v49.83,51.42
GPIO_21  (via drill 0.3)
  Top 0.305: v51.1,52.06 51.1,51.83 IC1.105
  Bottom 0.305: v51.1,52.06 44.75,52.06 33.32,63.49 SV4.23
GPIO_22  (via drill 0.3)
  Top 0.305: v49.83,46.98 49.83,47.03 IC1.100
  Bottom 0.305: SV4.24 34.59,68.25 34.59,63.17 45.07,52.69 51.73,52.69 52.05,52.38 52.05,49.2 v49.83,46.98
GPIO_27  (via drill 0.3)
  Top 0.305: v63.48,47.61 63.48,46.54 IC1.80
  Bottom 0.305: SV4.31 43.48,59.04 46.65,55.87 55.54,55.87 63.48,47.93 v63.48,47.61
GPIO_28  (via drill 0.3)
  Top 0.305: v64.75,47.61 64.75,45.69 IC1.77
  Bottom 0.305: SV4.32 44.75,68.25 44.75,58.73 46.97,56.5 55.86,56.5 v64.75,47.61
GPIO_29  (via drill 0.3)
  Top 0.305: v66.02,47.3 66.02,46.25 IC1.76
  Bottom 0.305: SV4.33 46.02,58.41 47.29,57.14 56.18,57.14 v66.02,47.3
GPIO_30  (via drill 0.3)
  Top 0.305: v66.97,47.3 66.97,42.27 IC1.72
  Bottom 0.305: SV4.34 47.29,68.25 47.29,66.03 47.92,65.39 47.92,59.04 49.19,57.77 56.5,57.77 v66.97,47.3
GPIO_31  (via drill 0.3)
  Top 0.305: v68.56,46.66 68.56,39.99 62.53,33.96 61.5,33.96 IC1.71
  Bottom 0.305: SV4.35 48.56,59.68 49.83,58.41 56.81,58.41 v68.56,46.66
GPIO_32  (via drill 0.3)
  Top 0.305: v69.51,46.66 69.51,40.31 62.85,33.33 60.72,33.33 IC1.69
  Bottom 0.305: SV4.36 49.83,68.25 49.83,59.99 50.78,59.04 57.13,59.04 v69.51,46.66
GPIO_33  (via drill 0.3)
  Top 0.305: v70.78,46.34 70.78,40.31 63.16,32.69 60.64,32.69 IC1.68
  Bottom 0.305: SV4.37 51.1,60.31 51.73,59.68 57.45,59.68 v70.78,46.34
GPIO_34  (via drill 0.3)
  Top 0.305: v71.74,46.34 71.74,40.31 63.48,32.05 60.57,32.05 IC1.67
  Bottom 0.305: SV4.38 52.37,68.25 52.37,61.27 53.32,60.31 57.77,60.31 v71.74,46.34
HDMI_CEC  (via drill 0.3)
  Top 0.305: U$1.P$13 65.37,61.92 v65.7,61.58 | v67.93,53.01 67.83,53.01 IC1.83
  Bottom 0.305: v65.7,61.58 65.7,55.87 67.93,53.65 v67.93,53.01
HDMI_CLKN
  Top 0.305: U$1.P$12 64.87,60.65 IC1.98
HDMI_CLKP
  Top 0.305: U$1.P$10 63.87,60.36 IC1.99
HDMI_DATA0N
  Top 0.305: U$1.P$9 63.37,61.27 IC1.101
HDMI_DATA0P
  Top 0.305: U$1.P$7 62.37,61.69 IC1.103
HDMI_DATA1N
  Top 0.305: U$1.P$6 61.87,62.83 59.35,60.31 46.65,60.31 34.59,48.56 34.59,45.32 IC1.132
HDMI_DATA1P
  Top 0.305: U$1.P$4 60.87,62.78 59.04,60.95 46.34,60.95 33.95,48.88 33.95,45.24 IC1.133
HDMI_DATA2N
  Top 0.305: U$1.P$3 60.37,63.23 58.72,61.58 46.02,61.58 33.32,49.2 33.32,45.17 IC1.134
HDMI_DATA2P
  Top 0.305: U$1.P$1 59.37,63.18 58.4,62.22 45.7,62.22 32.68,49.52 32.68,45.09 IC1.135
L2  (via drill 0.6)
  Top 0.61: R19.2 C9.1 4.82,48.54 v5.45,48.54 | 12.38,45.02 13.47,45.02 13.69,44.81 v13.69,43.72
  Top 1.27: C25.1 12.38,45.02 C26.1 C41.1 | C41.1 C42.1 C43.1 20.3,44.39 SJ4.1 | L2.P$1 14.81,43.98 C41.1
  Bottom 0.61: v13.69,43.72 13.69,45.58 9.8,49.47 6.38,49.47 v5.45,48.54
LED_0
  Top 0.254: RN6.4 50.46,22.36 IC1.39
LED_1
  Top 0.254: RN6.3 51.73,23.22 IC1.42
LED_2
  Top 0.254: RN6.2 53,22.65 IC1.43
LED_3
  Top 0.254: RN6.1 54.27,22.09 IC1.44
LED_4
  Top 0.254: RN5.4 60.62,22.21 60.31,22.53 55.25,22.53 IC1.46
LED_5
  Top 0.254: RN5.3 61.89,22.85 61.58,23.16 56.73,23.16 IC1.49
LED_6
  Top 0.254: RN5.2 63.16,22.85 62.21,23.8 56.81,23.8 IC1.50
LED_7
  Top 0.254: RN5.1 64.43,22.53 62.53,24.43 56.88,24.43 IC1.51
N$1  (via drill 0.3)
  Top 0.406: v19.03,6.02 18.71,6.02 18.4,5.7 18.4,4.85 R8.2
  Bottom 0.406: U3.10 19.14,6.13 v19.03,6.02
N$2
  Top 0.406: R8.1 22,4.75 D4.A
N$3
  Bottom 0.406: R1.1 16.81,14.7 16.81,7.92 15.79,6.91 U3.11 10.83,6.91 10.42,7.31 10.42,9.8 10.78,10.16 U3.16
N$4
  Top 0.61: U$11.3 8.55,56.18 8.24,55.87
  Top 1.27: 8.24,55.87 8.24,53.55 L3.P$2
N$5  (via drill 0.3)
  Top 0.406: v13.32,10.78 13.63,10.78 13.95,10.46 13.95,7.19 C1.2
  Bottom 0.406: U3.17 13.3,10.79 v13.32,10.78
N$6
  Bottom 0.406: R4.1 14.9,13.43 14.9,10.15 14.26,9.5 U3.15
N$7  (via drill 0.3)
  Top 0.406: v17.76,10.78 R11.1
  Bottom 0.406: SV1.1 21.25,8.56 21.89,9.2 21.89,10.15 21.25,10.78 U3.4 17.77,10.79 v17.76,10.78
N$8  (via drill 0.5)
  Top 0.61: C49.1 R2.2
  Top 1.016: C49.1 v4.43,63.17
  Top 1.27: C53.1 C52.1 C51.1 20.3,57.41 SJ6.1 | C53.1 C54.1 C55.1 | L3.P$1 v14.81,56.5 14.81,57 C53.1
  Bottom 1.016: v4.43,63.17 4.43,59.99 8.24,56.19 14.49,56.19 v14.81,56.5
N$9
  Top 0.61: C49.2 5.08,59.46 U$11.5 | C49.2 4.43,57.99 R5.2 | C49.2 R2.1
N$10  (via drill 0.3, 0.6)
  Top 0.406: v20.62,9.51 20.62,13.01 19.67,13.96 v19.35,13.96
  Bottom 0.305: 19.16,9.51 U3.6
  Bottom 0.406: 19.16,9.51 v20.62,9.51 | v19.35,13.96 19.03,14.28 R3.1 | U3.9 17.97,7.54 17.58,7.93 17.58,9.18 17.89,9.49 19.14,9.49 U3.6
N$11  (via drill 0.6)
  Top 0.508: X1.3 9.49,5.6 v9.96,5.13
  Bottom 0.406: D2.1 4.75,10.79
  Bottom 0.508: D2.1 4.74,10.77 4.74,9.83 3.47,8.56 3.47,6.66 4.53,5.6 9.49,5.6 v9.96,5.13
N$12
  Bottom 0.406: R12.1 15.86,14.38 15.86,8.88 15.18,8.2 U3.13
N$13  (via drill 0.3)
  Top 0.508: X1.2 9.31,6.4 v9.34,6.38
  Bottom 0.508: D2.6 6.97,10.49 6.97,6.79 7.38,6.38 v9.34,6.38
N$15
  Top 0.305: S6.7 77.45,28.25 75.86,26.66 RN3.3 71.42,26.66 70.78,27.29 70.78,29.52 71.1,29.83 RN2.3
N$16
  Bottom 0.406: C4.2 24.01,14.59 Q1.2 22.21,12.69 20.97,11.46 U3.3
N$17
  Bottom 0.406: C6.2 22.31,19.57 Q1.1 22.21,16.82 20.62,15.23 20.62,12.37 20.36,12.12 U3.2
N$22
  Top 0.305: S6.5 82.53,26.98 79.67,24.12 RN3.1 70.47,24.12 70.15,24.43 70.15,28.25 68.56,29.83 RN2.1
N$23
  Top 0.305: RN3.2 78.4,25.39 79.99,26.98 S6.6 79.99,31.74 79.67,32.05 70.47,32.05 69.83,31.42 RN2.2
N$24  (via drill 0.3)
  Top 0.305: IC1.9 36.49,33.69 36.49,34.59 v37.13,35.23
  Bottom 0.305: R33.2 31.41,35.55 32.05,34.91 36.49,34.91 36.81,35.23 v37.13,35.23
N$25
  Top 0.305: S6.8 74.91,28.88 73.96,27.93 RN3.4 72.37,28.25 RN2.4
N$29  (via drill 0.6)
  Top 0.305: C14.1 12.34,31.69 v13.54,30.49 | C16.1 14.58,31.69 13.38,30.49 14.65,30.49 14.81,30.34
  Top 0.61: R28.2 C23.1 5.24,35.63 v5.6,35.63
  Top 1.27: C14.1 C15.1 C16.1 C20.1 C22.1 20.57,31.69 20.3,31.42 SJ3.1 | L4.P$1 14.81,30.34 14.81,30.64
  Bottom 0.61: v13.54,30.49 13.54,32.36 10.27,35.63 v5.6,35.63
N$30
  Top 0.61: R29.2 4.85,31 4.43,31.42 C23.2 | C23.2 5.08,33.11 U$7.5 | R28.1 C23.2
N$31  (via drill 0.3)
  Top 0.305: v39.67,34.28 39.67,33.96 38.08,32.37 38.08,31.74 IC1.14
  Bottom 0.305: R34.2 33.32,36.18 33.95,35.55 36.18,35.55 36.49,35.87 38.08,35.87 v39.67,34.28
N$33
  Top 0.305: R36.1 55.13,46.68 IC1.92
N$45
  Top 0.61: RN5.8 65.39,18.72 66.34,17.77 LED7.A
N$46
  Top 0.61: RN5.7 63.16,17.25 LED6.A
N$47
  Top 0.61: RN5.6 61.89,17.25 LED5.A
N$48
  Top 0.61: RN5.5 59.67,18.72 58.72,17.77 LED4.A
N$49
  Top 0.61: RN6.8 55.23,18.72 56.18,17.77 LED3.A
N$50
  Top 0.508: X2.2 80.47,60.76 D3.6
N$51
  Top 0.61: RN6.7 53,17.25 LED2.A
N$52
  Top 0.61: RN6.6 51.73,17.25 LED1.A
N$53
  Top 0.61: 48.76,16.82 LED0.A 48.96,16.91 50.46,18.41 RN6.5
N$54
  Top 0.508: X2.3 79.67,61.56 D3.1
N$57
  Top 0.305: RN1.3 25.06,38.72 24.11,39.67 24.11,40.74 LED8.1
N$58
  Top 0.305: RN1.2 26.33,39.04 25.7,39.67 LED8.2
N$59
  Top 0.305: RN1.1 27.6,40.65 LED8.3
N$63
  Top 0.305: RN7.4 72.47,14.7 C2.1 78.51,13.96 RN13.5 79.67,14.91 80.31,15.54 84.12,15.54 84.44,15.23 84.44,10.76 S4.1 S4.2
N$64  (via drill 0.3)
  Top 0.305: RN13.6 80.94,12.37 81.58,11.73 81.58,7.92 80.94,7.29 75.55,7.29 v75.23,7.61 75.23,10.34 S3.1 | S3.2 75.17,5.26 v75.14,5.29
  Top 0.406: C3.1 75.57,10.78 S3.1 73.19,12.37 71.74,12.37 70.78,13.32 RN7.3
  Bottom 0.305: v75.14,5.29 75.14,7.52 v75.23,7.61
N$65  (via drill 0.3)
  Top 0.305: 66.34,9.34 66.34,8.88 68.56,6.66 81.26,6.66 82.21,7.61 RN13.7 | 66.34,9.34 66.34,10.34 S2.1 66.68,10.78 C5.2 | S2.2 66.28,5.44 v66.28,5.29 | v66.28,7.93 66.28,9.27 66.34,9.34
  Top 0.406: C5.2 68.03,11.52 69.51,13.01 RN7.2
  Bottom 0.305: v66.28,5.29 v66.28,7.93
N$67
  Top 0.305: RN13.8 83.48,12.05 82.85,11.42 82.85,7.29 81.58,6.02 59.22,6.02 S1.2 S1.1
  Top 0.406: 59.04,12.69 58.93,12.69 C7.2 | 59.04,12.69 66.66,12.69 RN7.1 | S1.1 57.39,11.04 59.04,12.69
N$68
  Top 0.305: S5.2 44.09,4.22 C8.1 47.74,4.22 47.76,4.2 47.76,8.94 R18.2
  Top 0.406: 46.34,4.19 C8.1 R17.1
  Top 0.61: R18.2 44.09,10.36 S5.1
N$75
  Top 0.305: Q2.1 33.32,18.72 32.37,19.67 32.37,20.62 U1.3
  Bottom 0.305: C82.2 34.8,18.62 Q2.1
N$76
  Top 0.305: Q2.2 29.83,18.79 U1.2
  Bottom 0.305: C81.2 29.93,18.62 Q2.2
N$77
  Top 0.508: X2.1 81.27,62.52 83.48,60.31 JP2.2 82.53,59.36 D3.5
N$78
  Top 0.61: L2.P$2 8.01,41.77 8.56,42.32 U$3.3
N$80
  Bottom 0.61: IC2.7 46.02,4.65 R23.2 45.6,4.23 R21.1
N$81
  Bottom 0.61: IC2.6 47.29,4.65 R23.1 47.5,2.73 R22.1
N$82
  Top 0.61: R19.1 C9.2 | C9.2 5.08,46.45 U$3.5 | C9.2 4.43,44.97 R20.2
N$83
  Bottom 1.016: RS485.1 26.02,4.12 29.19,0.94 48.88,0.94 49.51,1.57 49.51,2.42 R22.2
N$84
  Bottom 0.61: R21.2 43.48,2.53
  Bottom 1.016: RS485.3 36.18,4.12 37.76,2.53 R21.2
N$86
  Top 0.61: SJ2.2 27.32,26.73 27.32,28.53 U4.7
N$88
  Top 0.61: U$7.3 8.55,29.83 8.24,29.52
  Top 1.27: 8.24,29.52 8.24,27.2 L4.P$2
N$91  (via drill 0.3)
  Top 0.305: C29.1 34.55,26.37 34.91,26.02 34.91,24.75 | 34.91,24.75 34.91,24.58 U1.1 32.22,21.89 30.95,21.89 v30.39,21.33 30.14,21.09 30.14,20.94 28.56,19.36 28.56,15.86 29.51,14.91 R26.1 R27.1 | 34.91,24.75 35.54,24.12 36.57,24.12 U1.7
  Bottom 0.305: 31.63,22.21 B6.2 | B6.2 31.72,22.28 33.46,22.28 C28.2 | v30.39,21.33 30.77,21.33 B6.2
N$93  (via drill 0.3)
  Top 0.305: v40.29,21.78 36.94,21.78 v36.7,22.03
  Bottom 0.305: B5.2 C27.2 39.2,21.22 40.05,21.22 v40.29,21.78
  Bottom 0.406: 39.2,21.22 U2.4 | 37.19,21.22 37.02,21.49 | 37.02,21.49 v36.7,22.03 | U2.1 37.02,21.72 37.02,21.49
N$113
  Top 0.508: X2.4 78.87,62.37 78.09,61.58 76.6,61.58 R35.2
PLL_CLK0
  Top 0.305: U1.10 37.62,27.29 38.4,27.29 38.72,26.98 38.97,26.98 IC1.22
PLL_CLK1
  Top 0.305: IC1.23 39.03,26.34 38.4,26.34 38.08,26.66 37.69,26.66 U1.9
PLL_CLK2
  Top 0.305: IC1.24 38.8,25.39 38.54,25.39 U1.6
RESET  (via drill 0.3)
  Top 0.305: R17.2 49.19,9.83 46.97,12.05 42.84,12.05 41.26,13.64 v41.26,14.28 | v41.26,24.75 41.26,25.02 IC1.28
  Bottom 0.305: v41.26,14.28 41.26,15.86 40.94,16.18 40.94,24.43 v41.26,24.75
RGB_B  (via drill 0.3)
  Top 0.305: RN1.8 27.6,33.33 28.24,32.69 v31.1,32.69 | IC1.7 33.76,32.37 v33.32,32.37
  Bottom 0.305: v33.32,32.37 31.41,32.37 v31.1,32.69
RGB_G  (via drill 0.3)
  Top 0.305: RN1.6 v25.06,33.96 | v38.4,33.96 38.4,33.64 37.76,33.01 37.22,33.01 IC1.11
  Bottom 0.305: v25.06,33.96 36.49,33.96 36.81,34.28 38.08,34.28 v38.4,33.96
RGB_R  (via drill 0.3)
  Top 0.305: RN1.7 v26.33,33.33 | v37.13,33.64 37.13,33.62 IC1.10
  Bottom 0.305: v26.33,33.33 36.81,33.33 v37.13,33.64
RS485_DIR  (via drill 0.3)
  Top 0.305: v43.16,23.16 43.16,23.39 IC1.33
  Bottom 0.305: IC2.2 46.02,13.32 42.21,17.13 42.21,22.21 v43.16,23.16
  Bottom 0.61: IC2.3 47.29,10.15 | 47.29,10.15 48.34,9.09 R24.2 | IC2.2 46.02,10.78 46.65,10.15 47.29,10.15
RS485_RX  (via drill 0.3)
  Top 0.305: v41.89,24.12 42.48,24.12 IC1.31
  Bottom 0.305: IC2.1 44.75,13.64 41.57,16.82 41.57,23.8 v41.89,24.12
  Bottom 0.406: R25.2 43.8,8.56 44.75,9.51 IC2.1
RS485_TX  (via drill 0.3)
  Top 0.305: v43.48,22.21 43.16,22.21 42.53,22.85 42.53,23.46 IC1.32
  Bottom 0.305: IC2.4 48.56,13.32 47.92,13.96 46.34,13.96 42.84,17.45 42.84,21.58 v43.48,22.21
SO  (via drill 0.3)
  Top 0.305: U4.2 24.52,25.79 v23.16,24.43 | v31.74,26.18 31.74,26.42 R37.1
  Bottom 0.305: v23.16,24.43 26.33,27.61 26.97,27.61 29.51,25.07 30.46,25.07 31.57,26.18 v31.74,26.18
SW_0
  Top 0.305: IC1.61 58.87,29.52 66.66,29.52 68.24,27.93 RN3.5
SW_1
  Top 0.305: IC1.60 58.8,28.88 66.02,28.88 68.24,26.66 RN3.6
SW_2
  Top 0.305: IC1.59 58.73,28.25 65.39,28.25 68.24,25.39 RN3.7
SW_3
  Top 0.305: IC1.58 58.65,27.61 64.75,27.61 68.24,24.12 RN3.8
SWS_0
  Top 0.305: RN7.5 72.05,19.04 64.12,26.98 57.17,26.98 IC1.55
SWS_1
  Top 0.305: RN7.6 70.78,19.36 63.8,26.34 57.09,26.34 IC1.54
SWS_2
  Top 0.305: RN7.7 69.51,19.67 63.48,25.7 57.02,25.7 IC1.53
SWS_3
  Top 0.305: RN7.8 68.24,19.99 63.16,25.07 56.95,25.07 IC1.52
TCK  (via drill 0.3)
  Top 0.305: IC1.16 39.03,31.28 39.03,31.74 v38.72,32.05
  Bottom 0.305: v38.72,32.05 37.13,30.47 36.18,30.47 33.32,27.61 31.1,27.61 30.14,26.66 29.83,26.66 27.6,28.88 25.38,28.88 22.52,26.02 19.67,26.02 18.08,24.43 18.08,18.4 17.13,17.45 R1.2
TDI  (via drill 0.3)
  Top 0.305: v36.49,29.83 36.88,29.83 IC1.15
  Bottom 0.305: R3.2 19.03,24.43 19.98,25.39 22.84,25.39 25.7,28.25 27.29,28.25 29.83,25.7 30.14,25.7 31.41,26.98 33.64,26.98 v36.49,29.83
TDO  (via drill 0.3)
  Top 0.305: IC1.20 38.51,27.93 37.42,27.93 36.72,27.23 36.24,27.23 v35.54,27.93
  Bottom 0.305: R12.2 15.22,17.13 17.13,19.04 17.13,24.75 19.35,26.98 22.21,26.98 24.75,29.52 27.92,29.52 29.19,28.25 33,28.25 35.86,31.1 36.81,31.1 38.4,32.69 39.03,32.69 39.35,32.37 39.35,31.1 37.13,28.88 36.49,28.88 v35.54,27.93
TMS  (via drill 0.3)
  Top 0.305: v36.49,27.93 36.49,28.56 36.81,28.88 38.05,28.88 IC1.18
  Bottom 0.305: R4.2 13.32,16.82 16.17,19.67 16.17,25.07 18.71,27.61 21.57,27.61 24.43,30.47 28.24,30.47 29.83,28.88 32.68,28.88 35.54,31.74 36.49,31.74 38.08,33.33 39.35,33.33 39.99,32.69 39.99,29.52 38.4,27.93 v36.49,27.93
USB_D+
  Top 0.305: D3.3 78.42,56.2 77.13,54.91 67.61,54.91 IC1.86
USB_D-
  Top 0.305: D3.4 80.92,57.75 77.45,54.28 67.69,54.28 IC1.85
USB_ID
  Top 0.305: R6.2 69.66,57.67 IC1.87
  Top 0.406: R35.1 R6.2
VCCA  (via drill 0.3)
  Top 0.305: v42.21,31.42 43.16,31.42 46.02,28.56 46.02,24.83 IC1.35 | v58.4,38.41 58.88,38.41 IC1.75 | v54.91,40.63 52.37,43.17 v51.1,43.17 51.1,44.76 | 51.1,44.76 51.1,46.18 IC1.97 | 51.1,44.76 51.73,45.39 52.43,45.39 IC1.94 | 47.29,49.44 IC1.107 | v42.21,31.42 41.89,31.42 | v46.34,30.47 47.92,30.47 52.37,34.91 52.37,39.67 v47.29,44.76 | IC1.3 35.38,36.82 38.08,36.82 40.62,34.28 40.62,32.37 41.57,31.42 v42.21,31.42
  Top 0.406: v47.29,44.76 47.29,49.44 46.65,50.07 46.65,51.42 47.92,52.69 B3.2
  Bottom 0.254: C59.1 50.11,42.18 | v46.34,30.47 44.4,32.41 | 48.91,41.86 47.29,43.48
  Bottom 0.305: v58.4,38.41 57.13,38.41 v54.91,40.63 | 50.11,42.18 v51.1,43.17 | C59.1 48.91,41.86 | v42.21,31.42 | v42.21,31.42 C58.1 44.4,32.41 | 47.29,43.48 v47.29,44.76
VCCD  (via drill 0.3)
  Top 0.254: v52.37,41.58 52.69,41.58 v54.27,39.99 | IC1.37
  Top 0.305: v41.26,33.01 42.53,33.01 | 42.53,33.01 46.97,28.56 | 46.97,28.56 46.97,24.44 | 46.97,24.44 IC1.37 | 46.97,28.56 53,34.59 v53,37.77 | IC1.73 v59.35,37.45 | IC1.1 34.28,37.13 34.28,37.14 34.59,37.45 38.4,37.45 41.57,34.28 41.57,33.96 42.53,33.01 | B4.2 46.65,21.89 46.97,22.21 46.97,24.44
  Bottom 0.254: 51.42,39.36 v53,37.77
  Bottom 0.305: 51.42,39.36 51.42,40.56 C61.1 v52.37,41.58 | v54.27,39.99 57.13,37.13 59.04,37.13 v59.35,37.45 | v41.26,33.01 | v41.26,33.01 C64.1
VCCINT  (via drill 0.3)
  Top 0.254: IC1.102 v49,47.61
  Top 0.305: v45.38,26.66 43.6,26.66 IC1.29 | v45.38,26.66 45.38,24.91 IC1.34 | IC1.38 47.61,24.52 v47.61,26.66 47.61,27.93 48.24,28.56 | IC1.45 48.51,28.56 48.24,28.56 | 48.24,28.56 53.96,34.28 v53.96,35.87 55.86,37.77 | IC1.70 58.88,35.87 v57.45,35.87 57.45,39.09 IC1.78 | IC1.84 55.86,41.75 55.86,37.77 | 55.86,37.77 55.23,37.77 50.15,42.85 50.15,43.8 v49.83,44.12 48.56,45.39 48.56,47.17 v49,47.61 | IC1.116 v44.11,47.1 44.11,46.66 41.89,44.44 | 41.89,44.44 v38.72,41.26 36.81,39.36 36.3,39.36 IC1.138 | IC1.124 41.12,44.44 41.89,44.44 | v43.48,30.15 43.48,29.83 45.38,27.93 v45.38,26.66 | v35.86,36.18 35.84,35.87 IC1.5
  Top 0.406: B2.2 44.75,21.26 v45.07,21.58
  Bottom 0.254: C46.1 48.88,43.17
  Bottom 0.305: v45.38,26.66 v47.61,26.66 | C47.1 53.04,34.95 v53.96,35.87 v57.45,35.87 | 48.88,43.17 | 48.88,43.17 v49.83,44.12 | v44.11,47.1 48.49,47.1 v49,47.61 | v35.86,36.18 35.86,38.41 v38.72,41.26 C44.1 | v43.48,30.15 | v43.48,30.15 C45.1
  Bottom 0.406: v45.07,21.58 46.34,22.85 46.34,25.7 v45.38,26.66
VCCIO  (via drill 0.3)
  Top 0.254: 42.42,48.04 IC1.117 | v52.37,44.76 52.51,44.76 | IC1.139 34.64,40.26 | v36.81,38.09 36.81,38.14
  Top 0.305: IC1.26 42.43,27.61 42.43,29.21 42.47,29.25 | v48.24,27.29 48.24,25.29 IC1.40 | IC1.47 50.46,28.02 v50.46,29.52 53,32.05 | IC1.56 53.11,31.74 53.11,31.95 53,32.05 | 55.23,34.28 56.5,35.55 v56.5,40.63 56.86,40.63 IC1.81 | 55.23,34.28 55.23,33.87 IC1.62 | 53,32.05 55.23,34.28 | 52.51,44.76 IC1.93 53.96,46.2 53.96,48.2 55.07,49.32 56.22,49.32 R36.2 | IC1.117 43.16,47.34 43.16,46.66 v42.53,46.02 41.89,45.39 41.58,45.39 IC1.122 | v39.03,42.53 38.78,42.53 IC1.130 | v43.16,44.44 v36.81,38.09 34.27,38.09 31.2,35.02 B1.2 | 36.81,38.14 35.57,39.38 | 35.57,39.38 IC1.139 | IC1.17 39.24,30.79 40.94,30.79 42.47,29.25 | v44.43,27.61 44.11,27.61 42.47,29.25 | v35.22,38.72 35.22,39.04 35.57,39.38
  Bottom 0.305: C32.1 v50.46,29.52 v48.24,27.29 47.92,27.61 v44.43,27.61 44.43,28.25 41.57,31.1 41.57,31.74 40.62,32.69 40.62,35.23 | C36.1 54.91,41.58 | v56.5,40.63 55.54,41.58 54.91,41.58 | 54.91,41.58 52.37,44.12 v52.37,44.76 51.42,44.76 50.46,45.71 47.04,45.71 C35.1 v43.16,44.44 | v43.16,44.44 43.16,45.39 v42.53,46.02 | v39.03,42.53 41.26,42.53 v43.16,44.44 | v36.81,38.09 37.76,38.09 40.62,35.23 | 40.62,35.23 40.66,35.2 C34.1 | R33.1 R34.1 35.12,38.62 v35.22,38.72
  Bottom 0.61: C39.1 C38.1 C32.1 | C35.1 C40.1 C37.1
VIN  (via drill 0.6)
  Top 0.406: 3.48,22.06 3.27,22.06 JP1.2
  Top 0.5: 9.51,12.05 8.55,13.01 6.65,13.01 5.38,14.28 v5.38,18.4
  Top 0.508: X1.1 9.07,7.2 9.65,7.78 9.65,10.96 v9.51,11.1 9.51,12.05
  Top 1.016: Q3.3 9.76,22.36 C13.1 C12.1 5.75,22.11 D1.K 3.48,22.06
  Bottom 0.5: 8.98,11.62 8.87,11.73 D2.5 | v5.38,18.4 5.38,21.11
  Bottom 0.508: 5.38,21.11 5.38,21.19 4.51,22.06 3.32,22.06 JP1.2 | v9.51,11.1 8.98,11.62
(copper drawn outside any net)
  shapes: Top area x8

## Text on the board
tPlace: FPGABOARD V2 / Design: D. Keekstra / Scintilla Shock / Rev. 1.1 02.12.2019